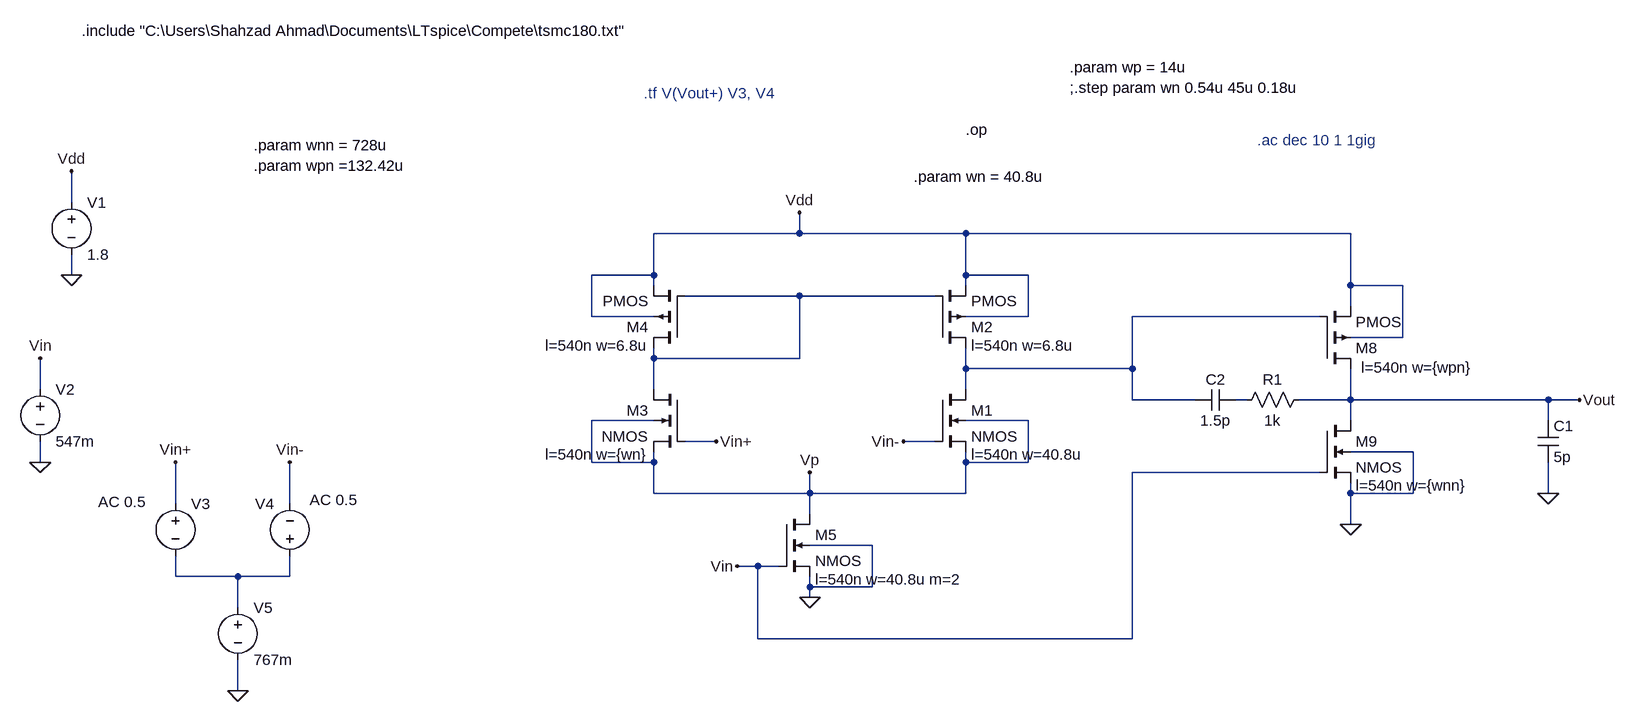
[diagram p0: schematic 2stage.asc]
2stage.asc, the LTspice schematic file:
Version 4
SHEET 1 1624 724
WIRE -768 -48 -768 -96
WIRE 352 0 352 -32
WIRE 352 0 128 0
WIRE 608 0 352 0
WIRE 1200 0 608 0
WIRE -768 64 -768 32
WIRE 128 64 128 0
WIRE 128 64 32 64
WIRE 608 64 608 0
WIRE 704 64 608 64
WIRE 128 80 128 64
WIRE 608 80 608 64
WIRE 1200 80 1200 0
WIRE 1280 80 1200 80
WIRE 352 96 176 96
WIRE 560 96 352 96
WIRE 1200 112 1200 80
WIRE 32 128 32 64
WIRE 128 128 32 128
WIRE 704 128 704 64
WIRE 704 128 608 128
WIRE 1152 128 864 128
WIRE 1280 160 1280 80
WIRE 1280 160 1200 160
WIRE 128 192 128 176
WIRE 352 192 352 96
WIRE 352 192 128 192
WIRE 608 208 608 176
WIRE 864 208 864 128
WIRE 864 208 608 208
WIRE -816 240 -816 192
WIRE 128 240 128 192
WIRE 608 240 608 208
WIRE 864 256 864 208
WIRE 960 256 864 256
WIRE 1040 256 1024 256
WIRE 1200 256 1200 208
WIRE 1200 256 1120 256
WIRE 1504 256 1200 256
WIRE 1552 256 1504 256
WIRE 128 288 32 288
WIRE 704 288 608 288
WIRE 1200 288 1200 256
WIRE 1504 288 1504 256
WIRE 224 320 176 320
WIRE 560 320 512 320
WIRE 1296 336 1200 336
WIRE -816 352 -816 320
WIRE 32 352 32 288
WIRE 128 352 128 336
WIRE 128 352 32 352
WIRE 608 352 608 336
WIRE 704 352 704 288
WIRE 704 352 608 352
WIRE 1152 368 864 368
WIRE 128 400 128 352
WIRE 368 400 368 368
WIRE 368 400 128 400
WIRE 608 400 608 352
WIRE 608 400 368 400
WIRE 1200 400 1200 384
WIRE 1296 400 1296 336
WIRE 1296 400 1200 400
WIRE 1504 400 1504 352
WIRE -608 416 -608 352
WIRE -432 416 -432 352
WIRE 368 432 368 400
WIRE 1200 448 1200 400
WIRE 464 480 368 480
WIRE 288 512 256 512
WIRE 320 512 288 512
WIRE -608 528 -608 496
WIRE -512 528 -608 528
WIRE -432 528 -432 496
WIRE -432 528 -512 528
WIRE 368 544 368 528
WIRE 464 544 464 480
WIRE 464 544 368 544
WIRE 368 560 368 544
WIRE -512 576 -512 528
WIRE 288 624 288 512
WIRE 864 624 864 368
WIRE 864 624 288 624
WIRE -512 704 -512 656
FLAG 352 -32 Vdd
FLAG 512 320 Vin-
FLAG 224 320 Vin+
FLAG -768 64 0
FLAG -768 -96 Vdd
FLAG -816 352 0
FLAG -816 192 Vin
FLAG 368 560 0
FLAG 256 512 Vin
FLAG -512 704 0
FLAG -608 352 Vin+
FLAG -432 352 Vin-
FLAG 368 368 Vp
FLAG 1200 448 0
FLAG 1552 256 Vout
FLAG 1504 400 0
DATAFLAG 1312 256 ""
DATAFLAG 736 208 ""
SYMBOL nmos4 560 240 R0
WINDOW 123 56 100 Left 2
SYMATTR Value2 l=540n w=40.8u
SYMATTR InstName M1
SYMBOL pmos4 560 176 M180
WINDOW 123 56 4 Left 2
SYMATTR Value2 l=540n w=6.8u
SYMATTR InstName M2
SYMBOL nmos4 176 240 M0
WINDOW 123 56 100 Left 2
SYMATTR Value2 l=540n w={wn}
SYMATTR InstName M3
SYMBOL pmos4 176 176 R180
WINDOW 123 56 4 Left 2
SYMATTR Value2 l=540n w=6.8u
SYMATTR InstName M4
SYMBOL voltage -768 -64 R0
WINDOW 123 0 0 Left 0
WINDOW 39 0 0 Left 0
SYMATTR InstName V1
SYMATTR Value 1.8
SYMBOL voltage -816 224 R0
WINDOW 123 24 124 Left 2
WINDOW 39 0 0 Left 0
SYMATTR InstName V2
SYMATTR Value 547m
SYMBOL nmos4 320 432 R0
WINDOW 123 56 100 Left 2
SYMATTR Value2 l=540n w=40.8u m=2
SYMATTR InstName M5
SYMBOL voltage -608 400 R0
WINDOW 123 -119 13 Left 2
WINDOW 39 0 0 Left 0
SYMATTR Value2 AC 0.5
SYMATTR InstName V3
SYMATTR Value ""
SYMBOL voltage -432 512 R180
WINDOW 0 24 96 Left 2
WINDOW 3 24 16 Left 2
WINDOW 123 -104 102 Left 2
WINDOW 39 0 0 Left 0
SYMATTR InstName V4
SYMATTR Value ""
SYMATTR Value2 AC 0.5
SYMBOL voltage -512 560 R0
WINDOW 123 0 0 Left 0
WINDOW 39 0 0 Left 0
SYMATTR InstName V5
SYMATTR Value 767m
SYMBOL pmos4 1152 208 M180
WINDOW 123 64 2 Left 2
SYMATTR Value2 l=540n w={wpn}
SYMATTR InstName M8
SYMBOL nmos4 1152 288 R0
WINDOW 123 56 100 Left 2
SYMATTR Value2 l=540n w={wnn}
SYMATTR InstName M9
SYMBOL cap 1488 288 R0
SYMATTR InstName C1
SYMATTR Value 5p
SYMBOL cap 1024 240 R90
WINDOW 0 0 32 VBottom 2
WINDOW 3 32 32 VTop 2
SYMATTR InstName C2
SYMATTR Value 1.5p
SYMBOL res 1136 240 R90
WINDOW 0 0 56 VBottom 2
WINDOW 3 32 56 VTop 2
SYMATTR InstName R1
SYMATTR Value 1k
TEXT 608 -160 Left 2 !.op
TEXT 768 -256 Left 2 !.param wp = 14u\n;.step param wn 0.54u 45u 0.18u
TEXT 528 -88 Left 2 !.param wn = 40.8u
TEXT 112 -216 Left 2 ;.tf V(Vout+) V3, V4
TEXT 1056 -144 Left 2 ;.ac dec 10 1 1gig
TEXT -752 -312 Left 2 !.include "C:\\Users\\Shahzad Ahmad\\Documents\\LTspice\\Compete\\tsmc180.txt"
TEXT -488 -136 Left 2 !.param wnn = 728u\n.param wpn =132.42u

The netlist it stands for:
* 2stage.asc
M1 N002 Vin- Vp Vp NMOS l=540n w=40.8u
M2 N002 N001 Vdd Vdd PMOS l=540n w=6.8u
M3 N001 Vin+ Vp Vp NMOS l=540n w={wn}
M4 N001 N001 Vdd Vdd PMOS l=540n w=6.8u
V1 Vdd 0 1.8
V2 Vin 0 547m
M5 Vp Vin 0 0 NMOS l=540n w=40.8u m=2
V3 Vin+ N004 AC 0.5
V4 N004 Vin- AC 0.5
V5 N004 0 767m
M8 Vout N002 Vdd Vdd PMOS l=540n w={wpn}
M9 Vout Vin 0 0 NMOS l=540n w={wnn}
C1 Vout 0 5p
C2 N003 N002 1.5p
R1 Vout N003 1k
.model NMOS NMOS
.model PMOS PMOS
.lib standard.mos
.op
.param wp = 14u
;.step param wn 0.54u 45u 0.18u
.param wn = 40.8u
* .tf V(Vout+) V3, V4
* .ac dec 10 1 1gig
.include "C:\Users\Shahzad Ahmad\Documents\LTspice\Compete\tsmc180.txt"
.param wnn = 728u
.param wpn =132.42u
.backanno
.end